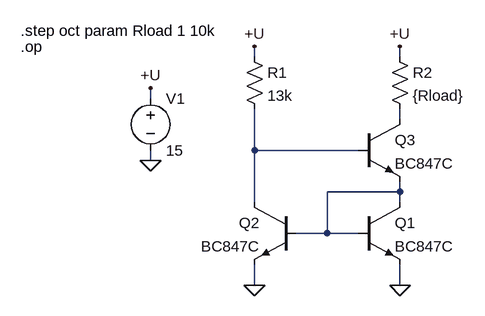
[diagram p0: schematic mirror-pnp.asc]
mirror-pnp.asc, the LTspice schematic file:
Version 4
SHEET 1 880 680
WIRE 208 48 208 32
WIRE 432 48 432 32
WIRE 48 112 48 96
WIRE 432 144 432 128
WIRE 208 192 208 128
WIRE 368 192 208 192
WIRE 48 208 48 192
WIRE 432 256 432 240
WIRE 432 256 320 256
WIRE 208 272 208 192
WIRE 432 272 432 256
WIRE 320 320 320 256
WIRE 320 320 272 320
WIRE 368 320 320 320
WIRE 208 400 208 368
WIRE 432 400 432 368
FLAG 48 208 0
FLAG 48 96 +U
FLAG 208 400 0
FLAG 432 400 0
FLAG 208 32 +U
FLAG 432 32 +U
SYMBOL voltage 48 96 R0
WINDOW 123 0 0 Left 2
WINDOW 39 0 0 Left 2
SYMATTR InstName V1
SYMATTR Value 15
SYMBOL npn 368 272 R0
SYMATTR InstName Q1
SYMATTR Value BC847C
SYMBOL npn 272 272 M0
SYMATTR InstName Q2
SYMATTR Value BC847C
SYMBOL res 192 32 R0
SYMATTR InstName R1
SYMATTR Value 13k
SYMBOL res 416 32 R0
SYMATTR InstName R2
SYMATTR Value {Rload}
SYMBOL npn 368 144 R0
SYMATTR InstName Q3
SYMATTR Value BC847C
TEXT -152 8 Left 2 !.step oct param Rload 1 10k
TEXT -152 32 Left 2 !.op

The netlist it stands for:
* mirror-pnp.asc
V1 +U 0 15
Q1 N003 N003 0 0 BC847C
Q2 N002 N003 0 0 BC847C
R1 +U N002 13k
R2 +U N001 {Rload}
Q3 N001 N002 N003 0 BC847C
.model NPN NPN
.model PNP PNP
.lib standard.bjt
.step oct param Rload 1 10k
.op
.backanno
.end